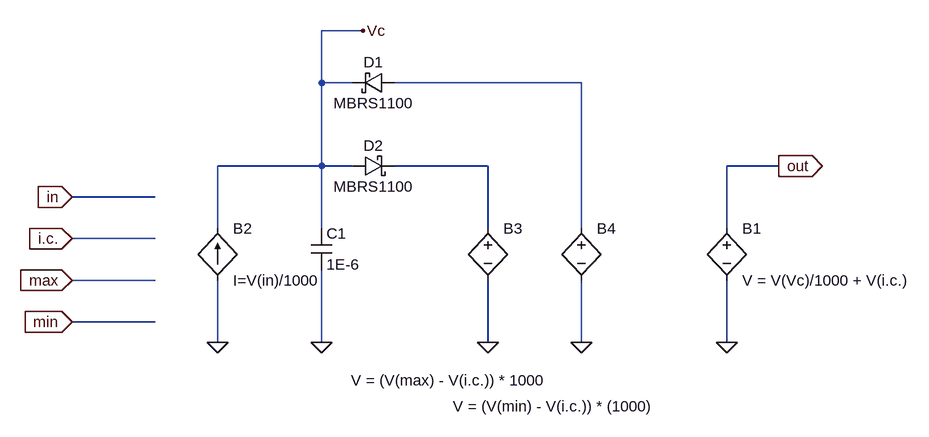
[diagram p0: schematic Integrator_clamped.asc]
Integrator_clamped.asc, the LTspice schematic file:
Version 4
SHEET 1 1360 680
WIRE 384 -176 320 -176
WIRE 320 -96 320 -176
WIRE 368 -96 320 -96
WIRE 720 -96 432 -96
WIRE 320 32 320 -96
WIRE 320 32 160 32
WIRE 368 32 320 32
WIRE 576 32 432 32
WIRE 1024 32 944 32
WIRE 64 80 -64 80
WIRE 160 128 160 32
WIRE 320 128 320 32
WIRE 576 128 576 32
WIRE 720 128 720 -96
WIRE 944 128 944 32
WIRE 64 144 -64 144
WIRE 64 208 -64 208
WIRE 64 272 -64 272
WIRE 160 304 160 208
WIRE 320 304 320 192
WIRE 576 304 576 208
WIRE 720 304 720 208
WIRE 944 304 944 208
FLAG -64 144 i.c.
IOPIN -64 144 In
FLAG 944 304 0
FLAG 1024 32 out
IOPIN 1024 32 Out
FLAG 160 304 0
FLAG 320 304 0
FLAG 384 -176 Vc
FLAG -64 208 max
IOPIN -64 208 In
FLAG -64 80 in
IOPIN -64 80 In
FLAG 576 304 0
FLAG 720 304 0
FLAG -64 272 min
IOPIN -64 272 In
SYMBOL bv 944 112 R0
SYMATTR InstName B1
SYMATTR Value V = V(Vc)/1000 + V(i.c.)
SYMBOL bi2 160 128 R0
SYMATTR InstName B2
SYMATTR Value I=V(in)/1000
SYMBOL cap 304 128 R0
SYMATTR InstName C1
SYMATTR Value 1E-6
SYMBOL bv 576 112 R0
WINDOW 3 -211 250 Left 0
SYMATTR Value V = (V(max) - V(i.c.)) * 1000
SYMATTR InstName B3
SYMBOL bv 720 112 R0
WINDOW 3 -198 290 Left 0
SYMATTR Value V = (V(min) - V(i.c.)) * (1000)
SYMATTR InstName B4
SYMBOL schottky 432 -112 R90
WINDOW 0 0 32 VBottom 0
WINDOW 3 32 32 VTop 0
SYMATTR InstName D1
SYMATTR Value MBRS1100
SYMATTR Description Diode
SYMATTR Type diode
SYMBOL schottky 368 16 M90
WINDOW 0 0 32 VBottom 0
WINDOW 3 32 32 VTop 0
SYMATTR InstName D2
SYMATTR Value MBRS1100
SYMATTR Description Diode
SYMATTR Type diode

The netlist it stands for:
* Integrator_clamped.asc
B1 out 0 V = V(Vc)/1000 + V(i.c.)
B2 0 Vc I=V(in)/1000
C1 Vc 0 1E-6
B3 N002 0 V = (V(max) - V(i.c.)) * 1000
B4 N001 0 V = (V(min) - V(i.c.)) * (1000)
D1 N001 Vc MBRS1100
D2 Vc N002 MBRS1100
.model D D
.lib standard.dio
.backanno
.end